# EAGLE design Braille_drive (EAGLE 9.4.2)
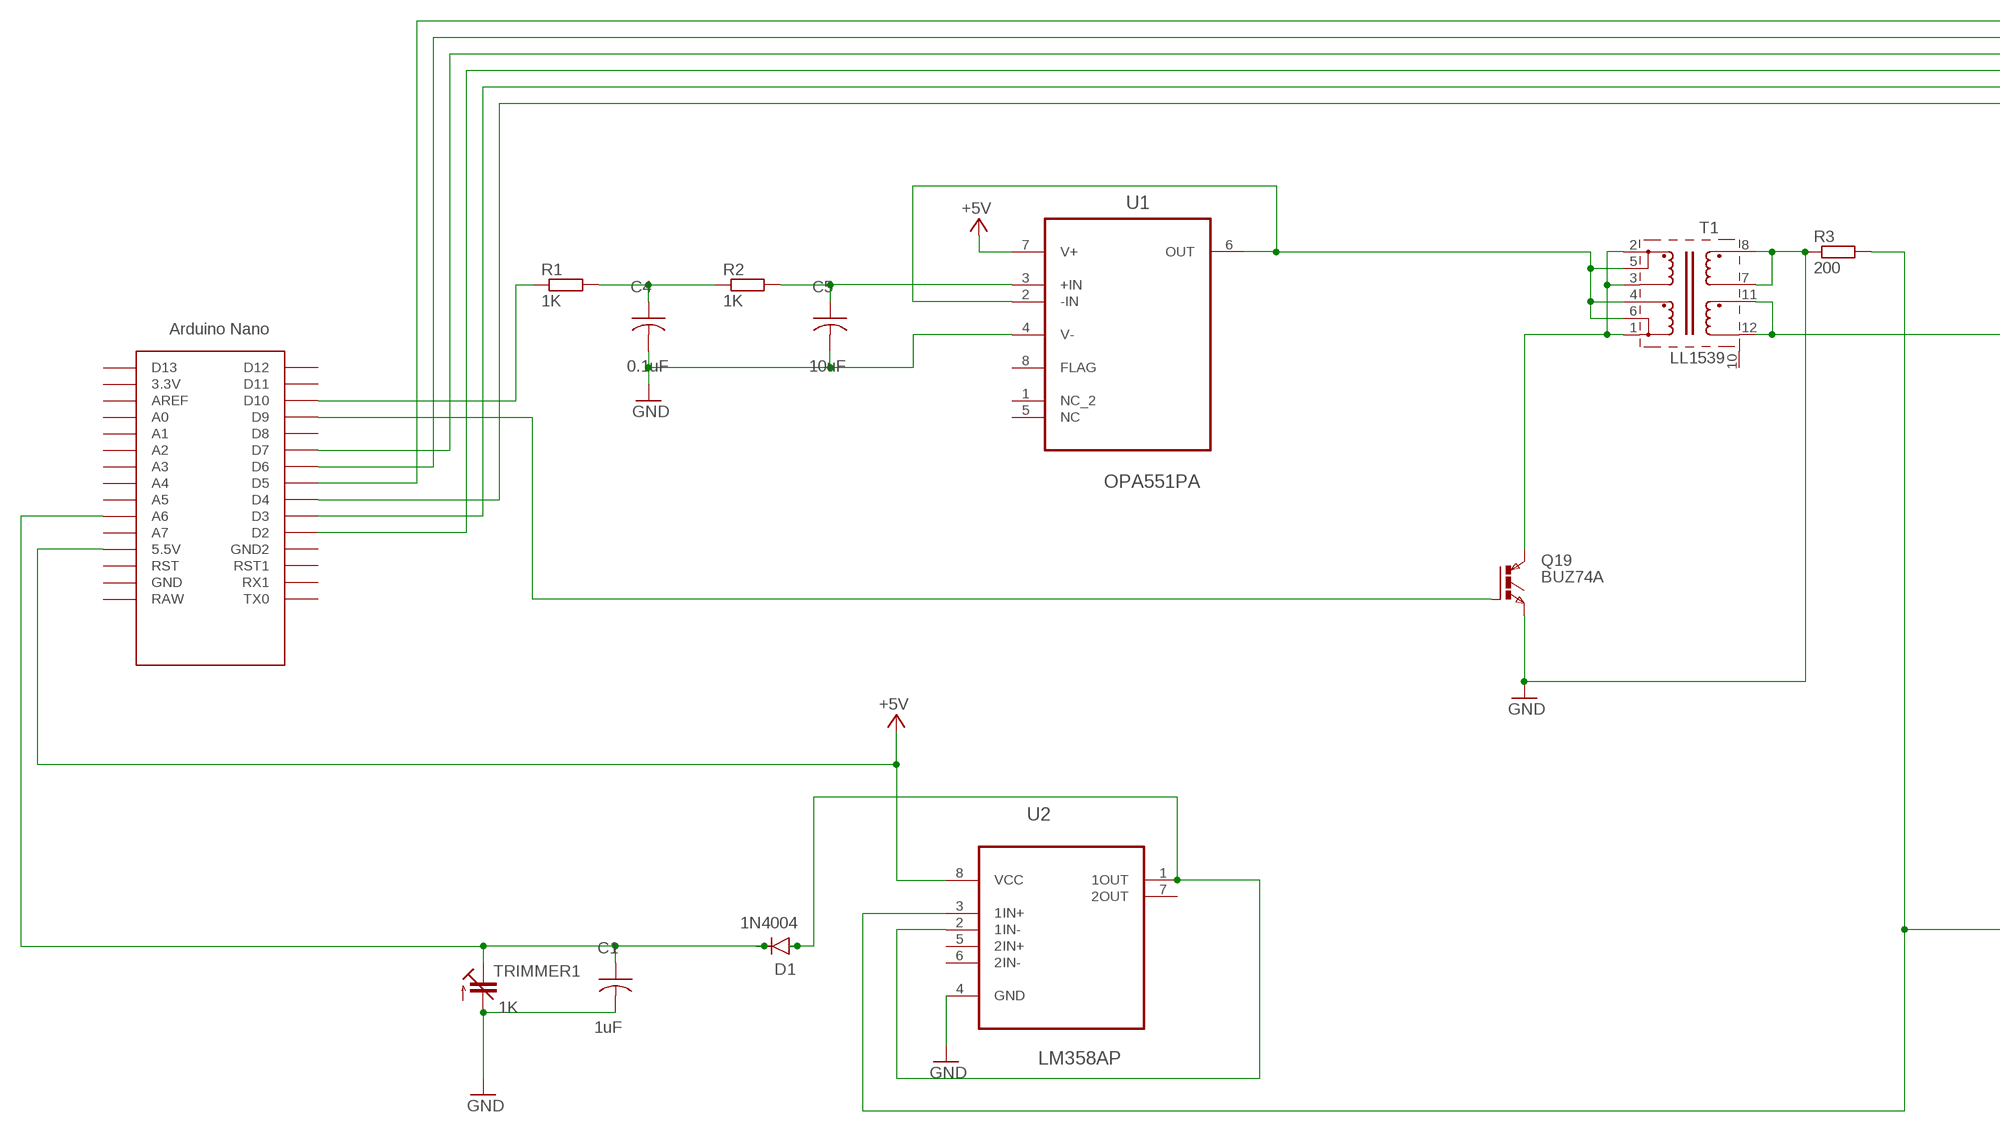
[diagram p0: schematic, sheet 1, part 1 of 2]
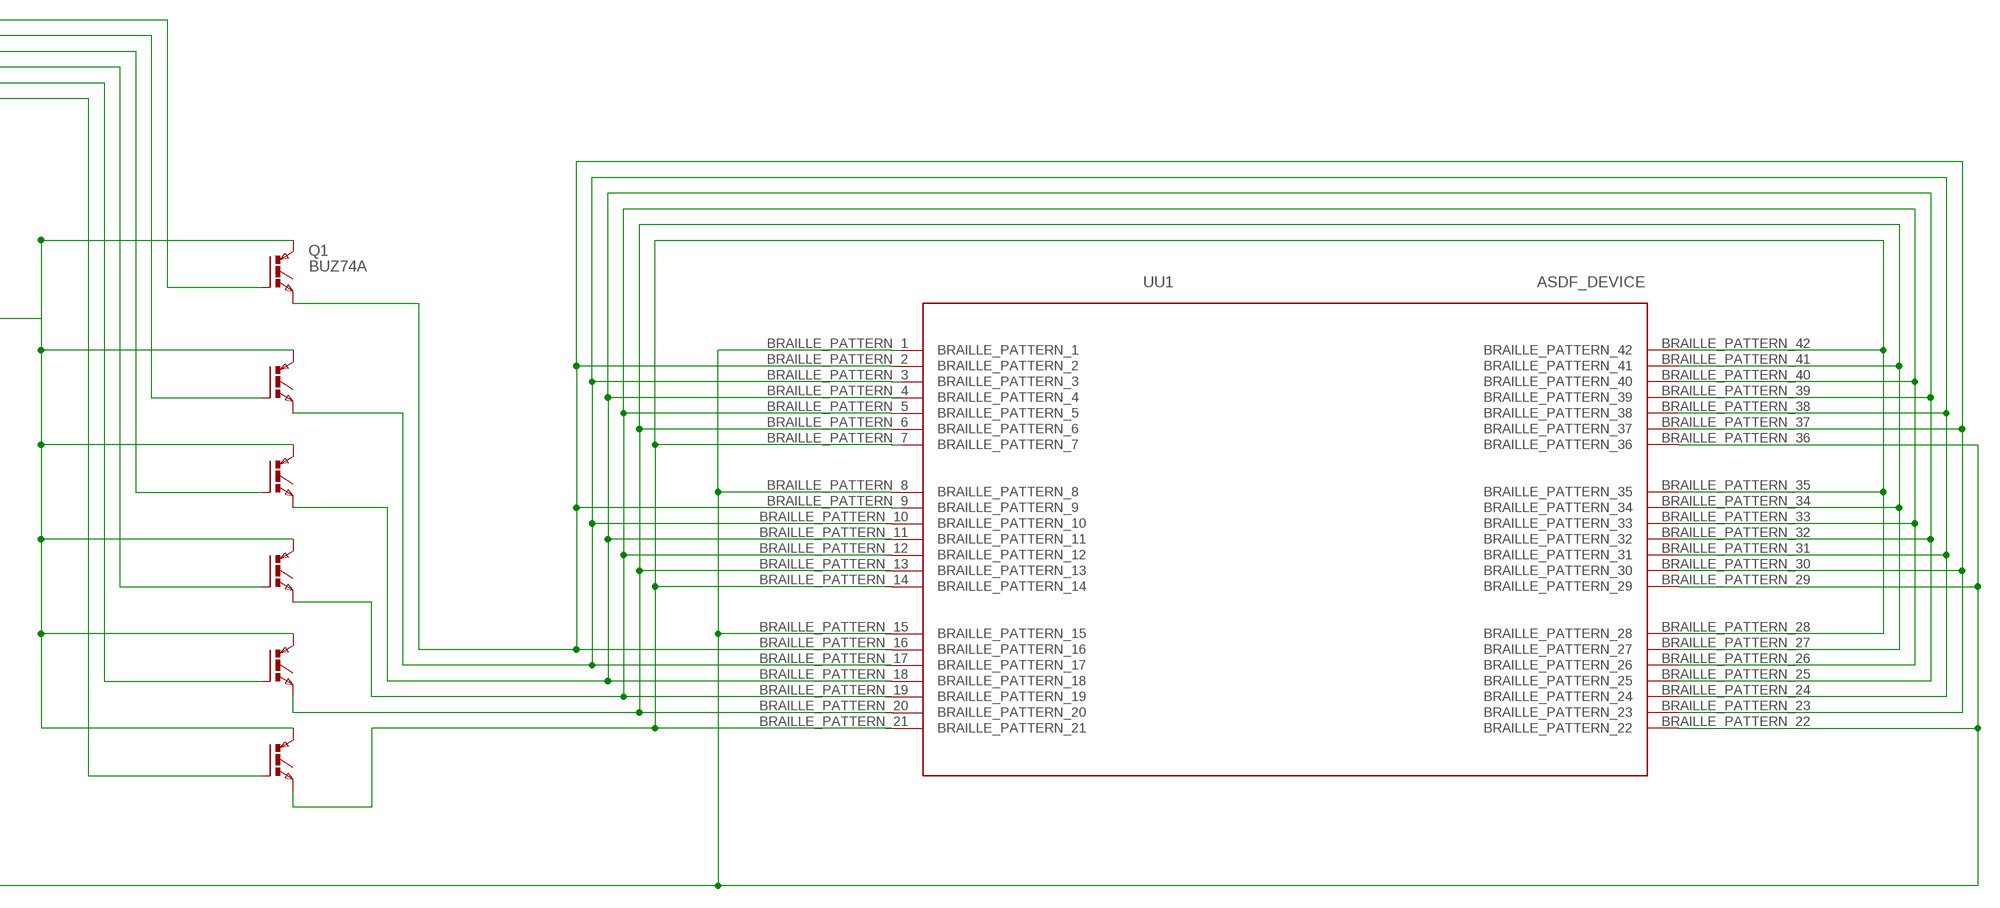
[diagram p1: schematic, sheet 1, part 2 of 2]

## Parts
C1  1uF  ECA-1HM100  [CAP_RADIAL_2MM]
C4  0.1uF  ECA-1HM100  [CAP_RADIAL_2MM]
C5  10uF  ECA-1HM100  [CAP_RADIAL_2MM]
D1  1N4004  [DO-41]
Q1  BUZ74A  IGBTTO220AV  [TO220AV]
Q2  BUZ74A  IGBTTO220AV  [TO220AV]
Q3  BUZ74A  IGBTTO220AV  [TO220AV]
Q4  BUZ74A  IGBTTO220AV  [TO220AV]
Q5  BUZ74A  IGBTTO220AV  [TO220AV]
Q6  BUZ74A  IGBTTO220AV  [TO220AV]
Q19  BUZ74A  IGBTTO220AV  [TO220AV]
R1  1K  R-EU_0204/2V  [0204V]
R2  1K  R-EU_0204/2V  [0204V]
R3  200  R-EU_0204/2V  [0204V]
T1  LL1539  [LL1539]
TRIMMER1  1K  C-TRIMM3040.452  [CTRIM3040.452]
U1  OPA551PA  [DIP254P762X508-8]
U2  LM358AP  [DIP254P762X508-8]
U$1  NANO  [NANO]
UU1  ASDF_DEVICE  [BRAILLE_PATTERN1]

## Nets
+5V: U1.7(V+) U2.8(VCC) U$1.5V(5.5V)
GND: C1.2 C4.2 C5.2 Q19.E R3.1 T1.7 T1.8 TRIMMER1.2(A) U1.4(V-) U2.4(GND)
N$1: R1.1 U$1.D10
N$2: C4.1 R1.2 R2.1
N$3: C5.1 R2.2 U1.3(+IN)
N$4: T1.4 T1.5 T1.6 U1.2(-IN) U1.6(OUT)
N$5: Q19.C T1.1 T1.2 T1.3
N$6: Q19.G U$1.D9
N$7: D1.A U2.1(1OUT) U2.2(1IN-)
N$8: C1.1 D1.C TRIMMER1.1A(E) U$1.A6
N$9: Q6.G U$1.D4
N$10: Q5.G U$1.D3
N$11: Q1.C Q2.C Q3.C Q4.C Q5.C Q6.C T1.11 T1.12
N$12: Q4.G U$1.D2
N$13: Q6.E UU1.BRAILLE_PATTERN_7 UU1.BRAILLE_PATTERN_14 UU1.BRAILLE_PATTERN_21 UU1.BRAILLE_PATTERN_28 UU1.BRAILLE_PATTERN_35 UU1.BRAILLE_PATTERN_42
N$14: Q3.G U$1.D7
N$15: Q2.G U$1.D6
N$16: Q1.G U$1.D5
N$17: R3.2 U2.3(1IN+) UU1.BRAILLE_PATTERN_1 UU1.BRAILLE_PATTERN_8 UU1.BRAILLE_PATTERN_15 UU1.BRAILLE_PATTERN_22 UU1.BRAILLE_PATTERN_29 UU1.BRAILLE_PATTERN_36
N$18: Q5.E UU1.BRAILLE_PATTERN_6 UU1.BRAILLE_PATTERN_13 UU1.BRAILLE_PATTERN_20 UU1.BRAILLE_PATTERN_27 UU1.BRAILLE_PATTERN_34 UU1.BRAILLE_PATTERN_41
N$22: Q1.E UU1.BRAILLE_PATTERN_2 UU1.BRAILLE_PATTERN_9 UU1.BRAILLE_PATTERN_16 UU1.BRAILLE_PATTERN_23 UU1.BRAILLE_PATTERN_30 UU1.BRAILLE_PATTERN_37
N$23: Q4.E UU1.BRAILLE_PATTERN_5 UU1.BRAILLE_PATTERN_12 UU1.BRAILLE_PATTERN_19 UU1.BRAILLE_PATTERN_26 UU1.BRAILLE_PATTERN_33 UU1.BRAILLE_PATTERN_40
N$24: Q3.E UU1.BRAILLE_PATTERN_4 UU1.BRAILLE_PATTERN_11 UU1.BRAILLE_PATTERN_18 UU1.BRAILLE_PATTERN_25 UU1.BRAILLE_PATTERN_32 UU1.BRAILLE_PATTERN_39
N$25: Q2.E UU1.BRAILLE_PATTERN_3 UU1.BRAILLE_PATTERN_10 UU1.BRAILLE_PATTERN_17 UU1.BRAILLE_PATTERN_24 UU1.BRAILLE_PATTERN_31 UU1.BRAILLE_PATTERN_38
Unconnected: T1.10 U1.1(NC_2) U1.5(NC) U1.8(FLAG) U2.5(2IN+) U2.6(2IN-) U2.7(2OUT) U$1.3.3V U$1.A0 U$1.A1 U$1.A2 U$1.A3 U$1.A4 U$1.A5 U$1.A7 U$1.AREF U$1.D8 U$1.D11 U$1.D12 U$1.D13 U$1.GND U$1.GND1(GND2) U$1.ICSP1 U$1.ICSP2 U$1.ICSP3 U$1.ICSP4 U$1.ICSP5 U$1.ICSP6 U$1.RAW U$1.RST U$1.RST1 U$1.RX1 U$1.TX0

## Library data of the parts
C1 C4 C5 = Resistor_Capacitor:ECA-1HM100: CAP ALUM 10UF 20% 50V RADIAL Manufacturer's datasheet <https://media.digikey.com/pdf/Data%20Sheets/Panasonic%20Electronic%20Components/ECA-xxM%20Series,TypeA.pdf>; CREATED_BY: PCBLayout.com; DIGIKEY_PART_NUMBER: P5178-ND; MANUFACTURER: Panasonic Electronic Components; MPN: ECA-1HM100; PACKAGE: CAP RADIAL 2MM LS
D1 = Diodes:1N4004: DIODE GEN PURP 400V 1A DO41 Manufacturer's datasheet <https://www.mccsemi.com/pdf/Products/1N4001-1N4007(DO-41).pdf>; CREATED_BY: PCBLayout.com; DIGIKEY_PART_NUMBER: 1N4004MSCT-ND; MANUFACTURER: Micro Commercial Co; MPN: 1N4004; PACKAGE: DO-41
Q1-Q6 Q19 = IGBT:IGBT: IGBT
R1-R3 = resistor:R-EU_: RESISTOR, European symbol
T1 = lundahl:LL1539: LL1539 Transformer
TRIMMER1 = resistor:C-TRIMM: Trimm capacitor
U1 = Texas Instruments_By_element14_Batch_1:OPA551PA: OPERATIONAL AMPLIFIER; MPN: OPA551PA; OC_FARNELL: 4427191; OC_NEWARK: 75C5068; PACKAGE: PDIP; SUPPLIER: Texas Instruments
U2 = Texas Instruments_By_element14_Batch_1:LM358AP: OPERATIONAL AMPLIFIER; MPN: LM358AP; OC_FARNELL: 1459520; OC_NEWARK: 67K0318; PACKAGE: PDIP; SUPPLIER: Texas Instruments
U$1 = Arduino-clone:NANO: Arduino Nano
UU1 = braille:ASDF_DEVICE

## Board
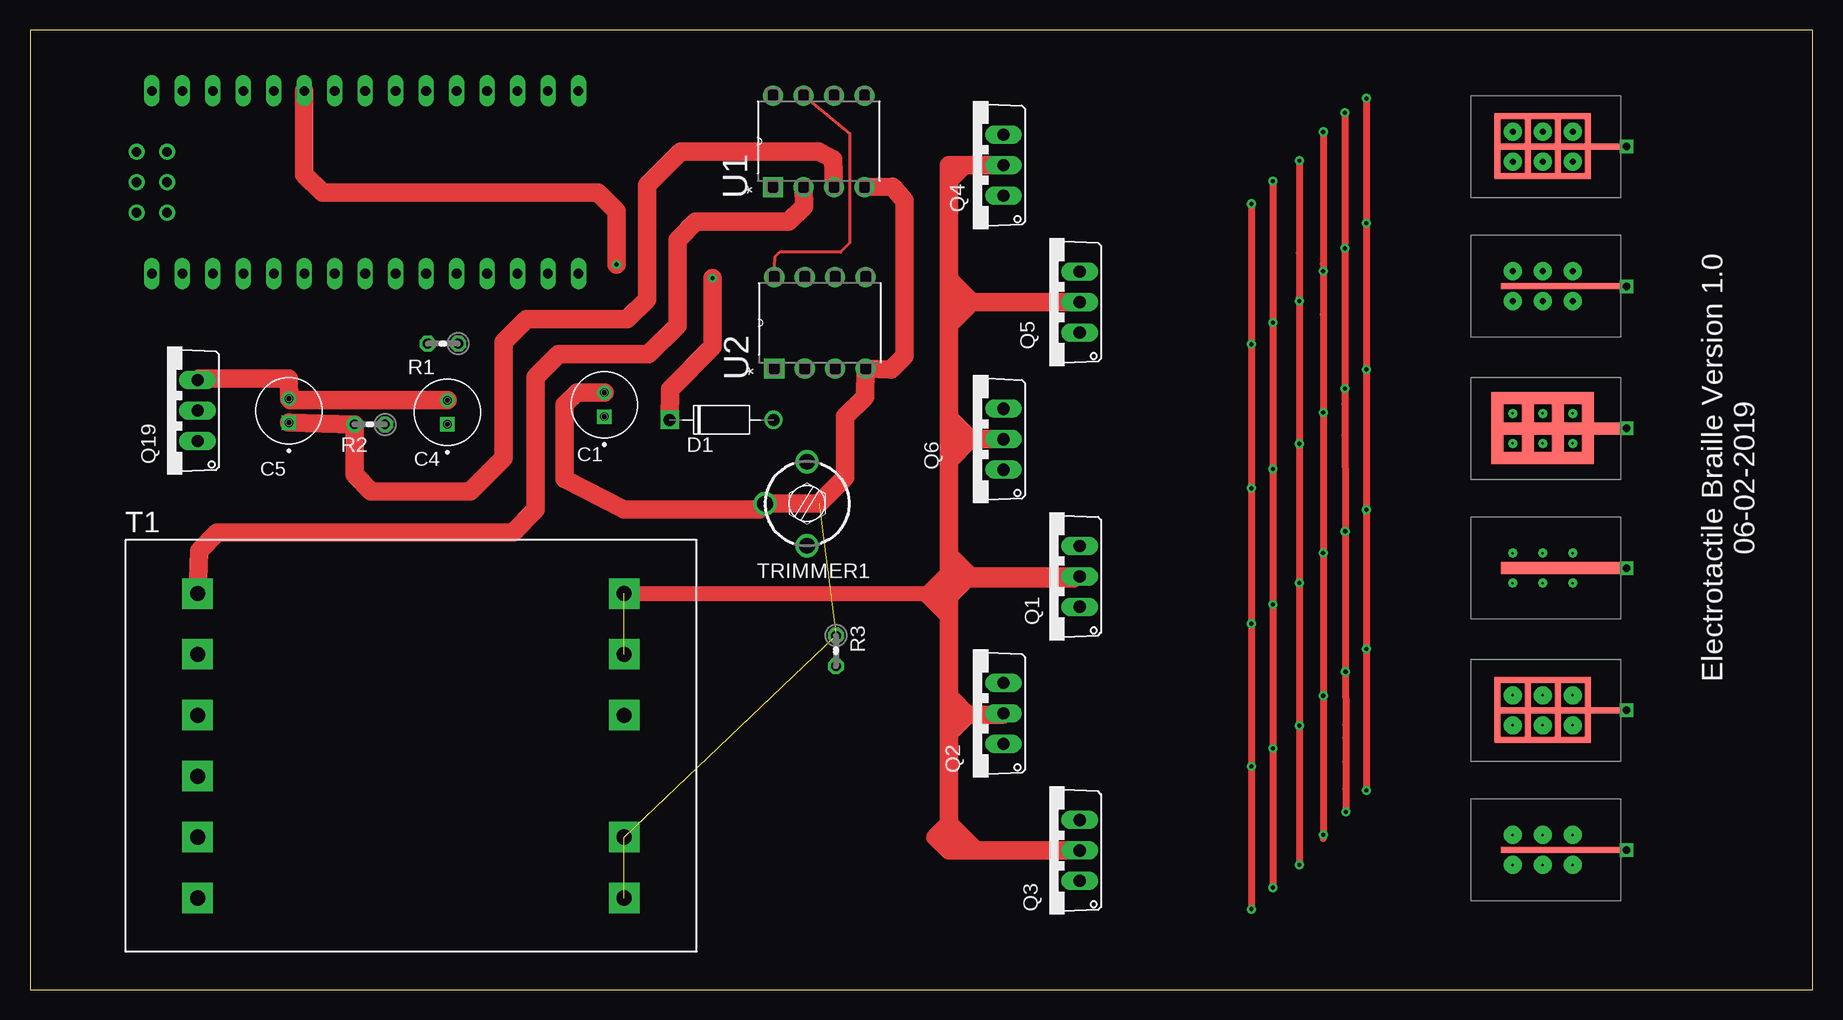
[diagram p2: board, top side]
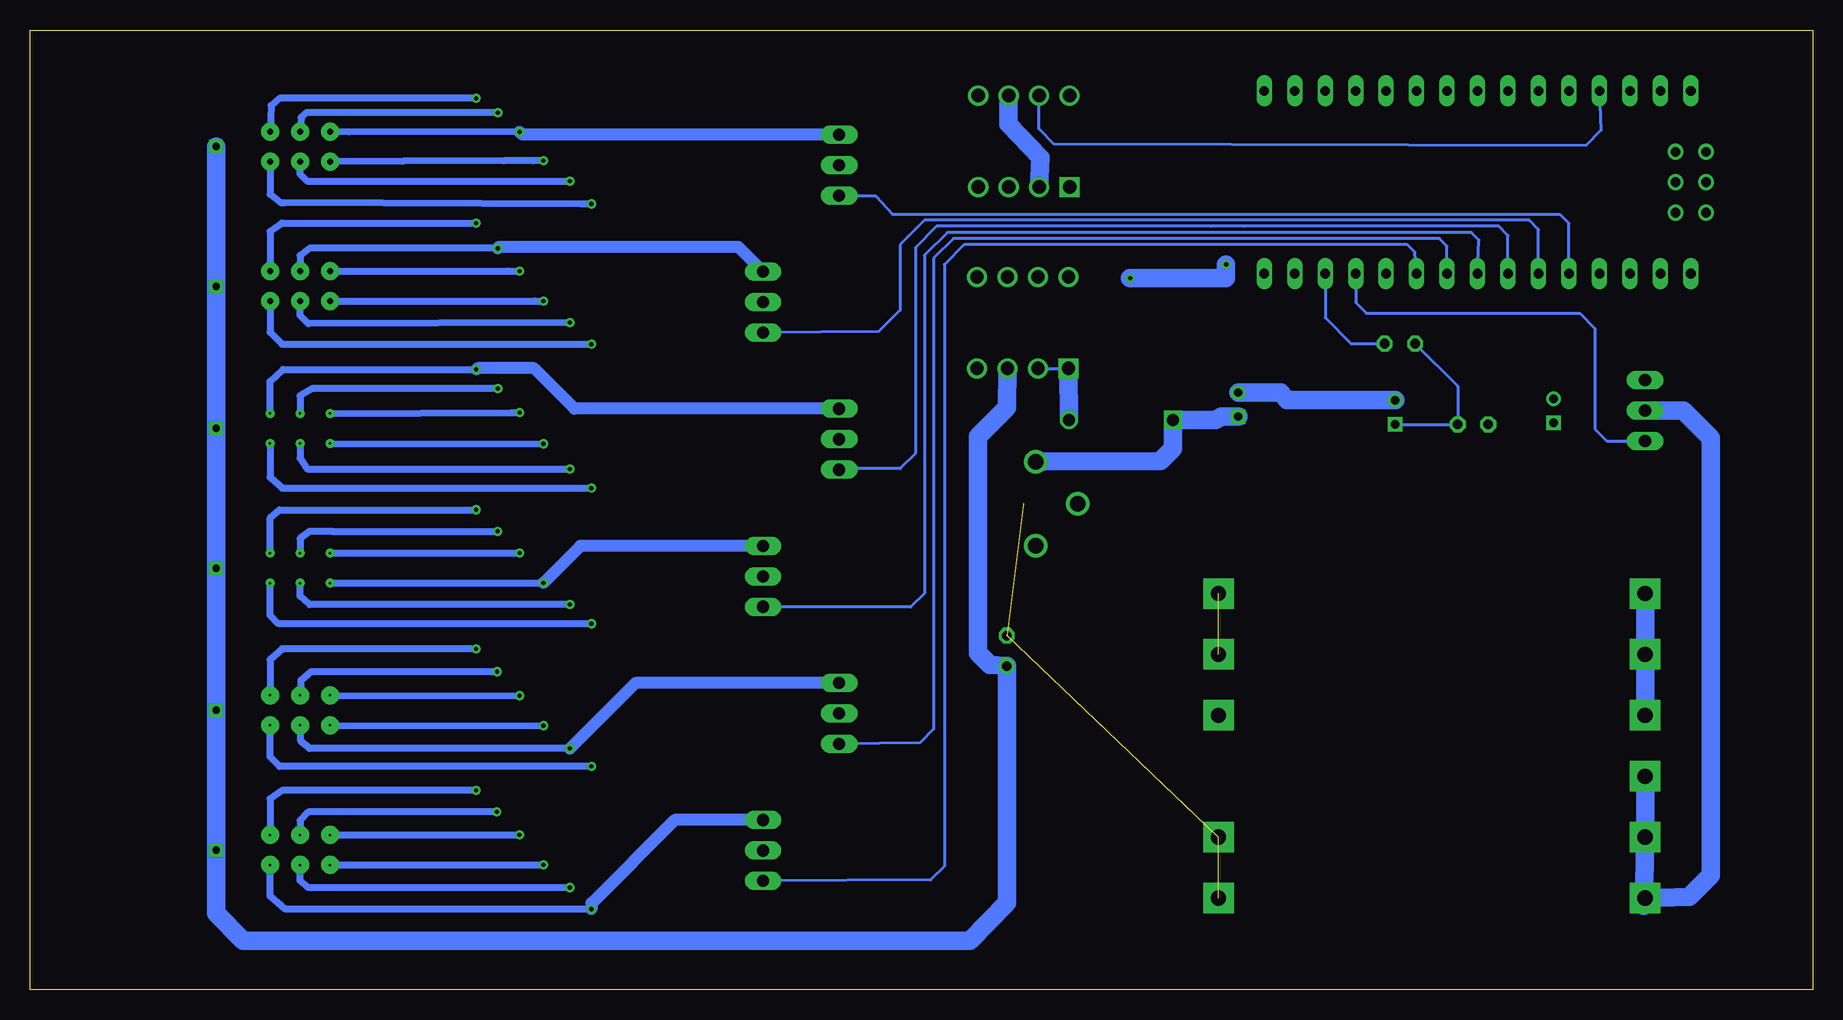
[diagram p3: board, bottom side, seen from below]

Size 148.6 x 80 mm. Coordinates in mm from the lower left corner, seen from the top.
Outline: 0,0 148.6,0 148.6,80 0,80 0,0
Copper layers (1*16): Top 0.035mm / dielectric 1.5mm / Bottom 0.035mm
Design rules "default *": minimum track width 0.1mm, minimum drill 0.35mm, track to track 10mil, track to pad 10mil, pad to pad 10mil, via to via 10mil, smd to smd 10mil, copper to edge 10mil, drill to drill 6mil, minimum pad ring 10mil, minimum via ring 8mil, stop-mask expansion 4mil, vias tented up to drill 0mil, thermal gap 10mil

### Footprints (pad centres in the part's own frame; a part is rotated, then mirrored left to right if it is on the bottom)
CAP_RADIAL_2MM = drill 0.7 pad 1.1 square: 1 -1,0 | drill 0.7 pad 1.1: 2 1,0
DO-41 = drill 1: A 4.325,0 | drill 1 square: C -4.325,0
TO220AV = drill 1.016 long: C 0,-2.54; E 2.54,-2.54; G -2.54,-2.54
0204V = drill 0.813 octagon: 1 -1.27,0; 2 1.27,0
LL1539 = drill 1.27 pad 2.54 square: 1 -17.78,-12.7; 2 -17.78,-7.62; 3 -17.78,-2.54; 4 -17.78,2.54; 5 -17.78,7.62; 6 -17.78,12.7; 7 17.78,-12.7; 8 17.78,-7.62; 10 17.78,2.54; 11 17.78,7.62; 12 17.78,12.7
CTRIM3040.452 = drill 1.3: 1A -3.5,0; 1B 3.5,0; 2 0,-3.5
DIP254P762X508-8 = drill 1.118 square: 1 -7.62,7.62 | drill 1.118: 2 -7.62,5.08; 3 -7.62,2.54; 4 -7.62,0; 5 0,0; 6 0,2.54; 7 0,5.08; 8 0,7.62
NANO = drill 0.8 long: 3.3V -10.16,24.13; 5V -10.16,-1.27; A0 -10.16,19.05; A1 -10.16,16.51; A2 -10.16,13.97; A3 -10.16,11.43; A4 -10.16,8.89; A5 -10.16,6.35; A6 -10.16,3.81; A7 -10.16,1.27; AREF -10.16,21.59; D2 5.08,1.27; D3 5.08,3.81; D4 5.08,6.35; D5 5.08,8.89; D6 5.08,11.43; D7 5.08,13.97; D8 5.08,16.51; D9 5.08,19.05; D10 5.08,21.59; D11 5.08,24.13; D12 5.08,26.67; D13 -10.16,26.67; GND -10.16,-6.35; GND1 5.08,-1.27; RAW -10.16,-8.89; RST -10.16,-3.81; RST1 5.08,-3.81; RX1 5.08,-6.35; TX0 5.08,-8.89 | drill 0.8: ICSP1 -5.08,-10.16; ICSP2 -5.08,-7.62; ICSP3 -2.54,-10.16; ICSP4 -2.54,-7.62; ICSP5 0,-10.16; ICSP6 0,-7.62
BRAILLE_PATTERN1 = smd 1 x 10: BRAILLE_PATTERN1 25.38,-4; BRAILLE_PATTERN9 37.04,-4 | smd 1 x 8: BRAILLE_PATTERN17 39.58,-2.5; BRAILLE_PATTERN18 34.58,-2.5 | smd 6 x 1: BRAILLE_PATTERN19 37.08,1.26; BRAILLE_PATTERN20 37.08,-6.25 | smd 5.4 x 1: BRAILLE_PATTERN21 37.08,-3.75; BRAILLE_PATTERN22 37.08,-1.25 | smd 0.5 x 10: BRAILLE_PATTERN29 48.88,-4; BRAILLE_PATTERN37 60.54,-4; BRAILLE_PATTERN51 1.88,-4; BRAILLE_PATTERN59 13.54,-4 | smd 0.5 x 8: BRAILLE_PATTERN39 63.08,-2.5; BRAILLE_PATTERN41 58.08,-2.5; BRAILLE_PATTERN61 16.08,-2.5; BRAILLE_PATTERN63 11.08,-2.5 | smd 5.4 x 0.5: BRAILLE_PATTERN40 60.58,1.26; BRAILLE_PATTERN42 60.58,-6.25; BRAILLE_PATTERN43 60.58,-3.75; BRAILLE_PATTERN44 60.58,-1.25; BRAILLE_PATTERN62 13.58,1.26; BRAILLE_PATTERN64 13.58,-6.25; BRAILLE_PATTERN65 13.58,-3.75; BRAILLE_PATTERN66 13.58,-1.25 | drill 0.6 square: BRAILLE_PATTERN_1 1.88,-9.5; BRAILLE_PATTERN_8 13.54,-9.5; BRAILLE_PATTERN_15 25.38,-9.5; BRAILLE_PATTERN_22 37.04,-9.5; BRAILLE_PATTERN_29 48.88,-9.5; BRAILLE_PATTERN_36 60.54,-9.5 | drill 0.2 pad 1.5: BRAILLE_PATTERN_2 0.63,0; BRAILLE_PATTERN_3 0.63,-2.5; BRAILLE_PATTERN_4 0.63,-5; BRAILLE_PATTERN_5 3.13,0; BRAILLE_PATTERN_6 3.13,-2.5; BRAILLE_PATTERN_7 3.13,-5; BRAILLE_PATTERN_9 12.29,0; BRAILLE_PATTERN_10 12.29,-2.5; BRAILLE_PATTERN_11 12.29,-5; BRAILLE_PATTERN_12 14.79,0; BRAILLE_PATTERN_13 14.79,-2.5; BRAILLE_PATTERN_14 14.79,-5 | drill 0.2 pad 0.75: BRAILLE_PATTERN_16 24.13,0; BRAILLE_PATTERN_17 24.13,-2.5; BRAILLE_PATTERN_18 24.13,-5; BRAILLE_PATTERN_19 26.63,0; BRAILLE_PATTERN_20 26.63,-2.5; BRAILLE_PATTERN_21 26.63,-5; BRAILLE_PATTERN_23 35.79,0; BRAILLE_PATTERN_24 35.79,-2.5; BRAILLE_PATTERN_25 35.79,-5; BRAILLE_PATTERN_26 38.29,0; BRAILLE_PATTERN_27 38.29,-2.5; BRAILLE_PATTERN_28 38.29,-5 | drill 0.5 pad 1.5: BRAILLE_PATTERN_30 47.63,0; BRAILLE_PATTERN_31 47.63,-2.5; BRAILLE_PATTERN_32 47.63,-5; BRAILLE_PATTERN_33 50.13,0; BRAILLE_PATTERN_34 50.13,-2.5; BRAILLE_PATTERN_35 50.13,-5; BRAILLE_PATTERN_37 59.29,0; BRAILLE_PATTERN_38 59.29,-2.5; BRAILLE_PATTERN_39 59.29,-5; BRAILLE_PATTERN_40 61.79,0; BRAILLE_PATTERN_41 61.79,-2.5; BRAILLE_PATTERN_42 61.79,-5

### Placement (x,y rotation side)
C1  47.88,48.77 90 top
C4  34.8,48.13 90 top
C5  21.59,48.26 90 top
D1  57.66,47.5 0 top
Q1  84.96,34.45 90 top
Q2  78.61,23.02 90 top
Q3  84.96,11.59 90 top
Q4  78.61,68.74 90 top
Q5  84.96,57.31 90 top
Q6  78.61,45.88 90 top
Q19  11.43,48.26 90 top
R1  34.42,53.85 180 top
R2  28.32,47.12 180 top
R3  67.18,28.24 270 top
T1  31.75,20.32 0 top
TRIMMER1  64.77,40.51 270 top
U1  69.56,74.53 90 top
U2  69.66,59.4 90 top
U$1  19.05,64.77 270 top
UU1  123.59,9.75 90 top

### Tracks (layer width: path | path; a pad name or v marks a point on that pad's centre or on a via)
+5V
  Top 0.254: U1.7 68.33,71.37 68.33,62.23 67.56,61.47 62.48,61.47 62.1,61.09 U2.8
  Bottom 0.254: U$1.5V 17.65,71.63 18.92,70.36 63.25,70.48 64.52,71.75 64.5,73.28 U1.7
GND  (3 unrouted)
  Top 1.524: Q19.E 14.1,50.93 21.57,50.93 C5.2 21.7,49.15 C4.2 | U1.4 71.88,66.93 72.9,65.79 72.9,52.83 71.75,51.69 U2.4 69.6,49.4 67.94,47.75 67.94,42.67 65.79,40.51 TRIMMER1.2 60.76,40.01 49.53,40.01 44.58,42.55 44.58,48.77 45.59,49.78 C1.2
  Bottom 1.524: C4.2 43.81,49.15 44.32,49.78 C1.2
N$1
  Bottom 0.254: U$1.D10 40.64,56.01 38.48,53.85 R1.1
N$2
  Bottom 0.254: R1.2 29.59,50.29 R2.1 34.8,47.12 C4.1
N$3
  Top 1.524: C5.1 R2.2 27.05,42.93 28.45,41.53 36.7,41.53 39.5,44.32 39.5,53.98 41.4,55.88 49.78,55.88 51.44,57.53 51.44,67.06 54.23,69.85 65.79,69.85 66.93,69.22 U1.3
N$4
  Top 1.524: U1.2 64.52,65.28 63.25,64.01 55.5,64.01 53.98,62.48 53.98,55.37 51.56,52.96 44.07,52.96 42.16,51.05 42.16,40.01 40.26,38.1 15.62,38.1 14.1,36.58 T1.6
  Bottom 1.524: T1.4 T1.5 T1.6 | U1.6 67.06,72.14 64.39,69.34 U1.2
N$5
  Bottom 1.524: Q19.C 10.79,48.26 8.51,45.97 8.51,9.53 10.29,7.75 T1.1 14.1,6.99 T1.2 T1.3
N$6
  Bottom 0.254: U$1.D9 38.1,57.28 37.21,56.39 19.43,56.39 18.16,55.12 18.16,46.74 17.14,45.72 Q19.G
N$7
  Bottom 0.254: U2.2 U2.1
  Bottom 1.524: D1.A U2.1
N$8  (via drill 0.35)
  Top 1.524: D1.C 53.34,50.04 56.9,53.59 v56.9,59.31 | v48.9,60.45 48.9,64.9 47.37,66.42 24.38,66.42 22.86,67.94 U$1.A6
  Bottom 0.254: 50.29,47.75 50.67,47.5 53.09,47.5 D1.C | 64.14,44.04 TRIMMER1.1A
  Bottom 1.524: C1.1 49.28,47.75 49.78,47.5 53.09,47.5 | D1.C 53.34,45.09 54.36,44.07 64.14,44.04 | v56.9,59.31 48.9,59.31 v48.9,60.45
N$9
  Bottom 0.254: U$1.D4 25.4,62.87 26.16,63.63 47.37,63.63 50.16,63.63 73.03,63.63 74.8,61.85 74.8,44.7 76.07,43.43 80.14,43.43 Q6.G
N$10
  Bottom 0.254: U$1.D3 22.86,63.37 23.62,64.14 74.04,64.14 76.07,62.1 76.07,56.64 77.85,54.86 Q5.G
N$11  (1 unrouted)
  Top 0.406: 76.35,33.02 76.6,33.27 | 76.6,34.42 75.2,33.02 74.8,33.02 74.8,32.78 | 76.6,34.82 76.6,35.31
  Top 1: Q1.C 87.05,34 76.6,34 | 77.22,45.88 76.6,45.88 | 77.09,57.31 76.6,57.31 | 76.6,59.18 76.6,57.31 | 76.6,57.31 76.6,54.99 | 76.6,48.39 76.6,45.88 | 76.6,45.88 76.6,44.07 | 76.6,34.42 76.6,34 | 76.6,34 76.6,33.27 76.6,32.51
  Top 1.27: T1.12 74.8,33.02 | 76.35,33.02 74.8,33.02 | 74.8,33.02 76.6,34.82 | 76.6,30.99 74.8,32.78
  Top 1.524: Q4.C 77.85,68.74 | 77.85,68.74 76.6,68.74 76.6,67.69 | 76.6,67.69 76.6,59.18 | 76.6,59.18 76.6,55.42 | 76.6,47.64 76.6,44.12 | 76.6,36.2 76.6,44.07 76.6,44.12 | 76.6,36.2 76.6,35.31 76.6,34.42 | 76.6,34.42 76.6,33.27 76.6,32.82 | 76.6,24.13 76.6,30.99 76.6,32.51 76.6,32.82 | 76.6,24.13 76.6,22.9 | 76.6,22.9 78.11,22.9 | 78.11,22.9 81.03,22.9 Q2.C | Q1.C 78.23,34.45 | 78.23,34.45 76.63,34.45 76.6,34.42 | Q6.C 78.36,45.88 | 78.36,45.88 77.22,45.88 | Q5.C 78.49,57.31 | 78.49,57.31 77.09,57.31 | Q3.C 78.82,11.59 | 78.82,11.59 76.6,11.59 | 76.6,22.9 76.6,21.46 | 76.6,21.46 76.6,13.81 | 76.6,13.81 76.6,11.59 | 76.6,11.59 75.49,12.7 76.6,13.81 | 76.6,13.81 78.82,11.59 | 77.85,68.74 76.8,67.69 76.6,67.69 | 78.49,57.31 76.6,55.42 | 76.6,55.42 76.6,54.99 76.6,48.39 76.6,47.64 | 78.49,57.31 76.61,59.18 76.6,59.18 | 78.36,45.88 76.6,44.12 | 78.36,45.88 76.6,47.64 | 76.6,36.2 78.23,34.56 78.23,34.45 | 78.23,34.45 76.6,32.82 | 78.11,22.9 76.88,24.13 76.6,24.13 | 78.11,22.9 76.67,21.46 76.6,21.46
N$12
  Bottom 0.254: U$1.D2 20.32,63.88 21.08,64.64 76.71,64.64 78.11,66.17 Q4.G
N$13  (via drill 0.35)
  Top 0.6: v111.4,74.3 v111.4,63.9 v111.4,51.7 v111.4,40 v111.4,28.4 v111.4,16.6
  Bottom 0.6: UU1.BRAILLE_PATTERN_42 128.5,73.7 127.8,74.3 v111.4,74.3 | UU1.BRAILLE_PATTERN_35 128.6,63.2 127.6,63.9 v111.4,63.9 | UU1.BRAILLE_PATTERN_28 128.6,50.7 127.5,51.7 v111.4,51.7 | UU1.BRAILLE_PATTERN_21 128.6,39.3 127.8,40 v111.4,40 | UU1.BRAILLE_PATTERN_14 128.6,27.5 127.6,28.4 v111.4,28.4 | UU1.BRAILLE_PATTERN_7 128.6,15.9 127.6,16.6 v111.4,16.6
  Bottom 1: Q6.E 103.22,48.42 106.6,51.8 111.3,51.8 v111.4,51.7
N$14
  Bottom 0.254: U$1.D7 33.15,61.47 33.78,62.1 70.74,62.1 72.39,60.45 72.39,10.29 73.53,9.14 Q3.G
N$15
  Bottom 0.254: U$1.D6 30.48,61.98 31.11,62.61 46.23,62.61 46.99,62.61 71.63,62.61 73.28,60.96 73.28,21.72 74.42,20.57 Q2.G
N$16
  Bottom 0.254: U$1.D5 27.81,62.48 28.45,63.12 47.24,63.12 48.39,63.12 72.14,63.12 74.04,61.21 74.04,33.02 75.18,31.88 Q1.G
N$17
  Bottom 1.524: UU1.BRAILLE_PATTERN_36 UU1.BRAILLE_PATTERN_29 UU1.BRAILLE_PATTERN_22 UU1.BRAILLE_PATTERN_15 UU1.BRAILLE_PATTERN_8 UU1.BRAILLE_PATTERN_1 133.1,6.35 130.81,4.06 70.23,4.06 67.18,7.24 R3.2 68.58,27.05 69.6,28.07 69.6,46.1 67.18,48.51 U2.3
N$18  (via drill 0.35)
  Top 0.6: v109.6,73.1 v109.6,61.8 v109.6,50.1 109.6,48.8 | 109.6,48.8 109.6,46.2 | 109.6,48.8 v109.63,38.2 v109.66,26.5 109.67,22.1 | 109.67,22.1 109.67,21 109.68,19 109.69,16.7 | 109.67,22.1 v109.69,14.8
  Bottom 0.6: UU1.BRAILLE_PATTERN_41 126,72.7 125.6,73.1 v109.6,73.1 | UU1.BRAILLE_PATTERN_34 126.1,61.2 125.3,61.8 v109.6,61.8 | UU1.BRAILLE_PATTERN_27 126.1,49.5 125.1,50.1 v109.6,50.1 | v109.63,38.2 123.4,38.2 124.9,38.2 125.3,38.2 126.1,37.6 UU1.BRAILLE_PATTERN_20 | UU1.BRAILLE_PATTERN_13 126.03,25.79 125.2,26.5 v109.66,26.5 | UU1.BRAILLE_PATTERN_6 126.1,14.1 125.4,14.8 v109.69,14.8
  Bottom 1: Q5.E 89.55,61.9 109.5,61.9 v109.6,61.8
N$22  (via drill 0.35)
  Top 0.6: v105.8,69.09 105.8,61.4 | 105.8,61.4 105.8,57.7 | 105.8,61.4 v105.8,57.4 v105.8,45.5 v105.8,33.9 v105.8,22 v105.8,10.4
  Bottom 0.6: UU1.BRAILLE_PATTERN_37 117.5,69.06 109.1,69.08 | 106.7,69.09 109.1,69.08 | v105.8,69.09 109.1,69.08 | UU1.BRAILLE_PATTERN_30 106.5,57.4 v105.8,57.4 | UU1.BRAILLE_PATTERN_23 v105.8,45.5 | UU1.BRAILLE_PATTERN_16 v105.8,33.9 | UU1.BRAILLE_PATTERN_9 v105.8,22 | UU1.BRAILLE_PATTERN_2 v105.8,10.4
  Bottom 1: Q1.E 102.71,36.99 v105.8,33.9
N$23  (via drill 0.35)
  Top 0.6: v107.8,71.5 107.8,60.5 | 107.8,60.5 107.8,56.3 | 107.8,60.5 v107.8,59.9 v107.8,48.1 v107.8,36.4 v107.8,24.5 v107.8,12.9 107.8,12.6
  Bottom 0.6: v107.8,71.5 122,71.5 UU1.BRAILLE_PATTERN_40 | UU1.BRAILLE_PATTERN_33 108.8,59.9 v107.8,59.9 | UU1.BRAILLE_PATTERN_26 108.5,48.1 v107.8,48.1 | UU1.BRAILLE_PATTERN_19 v107.8,36.4 | UU1.BRAILLE_PATTERN_12 v107.8,24.5 | UU1.BRAILLE_PATTERN_5 v107.8,12.9
  Bottom 1: Q4.E 107.58,71.28 v107.8,71.5
N$24  (via drill 0.35)
  Top 0.6: v101.8,65.5 v101.8,53.8 v101.8,41.8 v101.8,30.5 v101.8,18.6 v101.8,6.7
  Bottom 0.6: UU1.BRAILLE_PATTERN_39 128.6,66.3 127.7,65.6 127.4,65.59 102.7,65.5 v101.8,65.5 | UU1.BRAILLE_PATTERN_32 128.6,54.8 127.6,53.8 v101.8,53.8 | UU1.BRAILLE_PATTERN_25 128.6,42.7 127.6,41.8 v101.8,41.8 | UU1.BRAILLE_PATTERN_18 128.6,31.2 127.9,30.5 v101.8,30.5 | UU1.BRAILLE_PATTERN_11 128.6,19.4 127.8,18.6 v101.8,18.6 | UU1.BRAILLE_PATTERN_4 128.6,7.8 127.3,6.7 v101.8,6.7
  Bottom 1: Q3.E 94.87,14.13 101.8,7.2 v101.8,6.7
N$25  (via drill 0.35)
  Top 0.6: v103.6,67.4 v103.6,55.6 v103.6,43.4 v103.6,32.1 v103.6,20.1 v103.6,8.5
  Bottom 0.6: UU1.BRAILLE_PATTERN_38 126.1,68 125.5,67.4 v103.6,67.4 | UU1.BRAILLE_PATTERN_31 126.1,56.2 125.4,55.5 v103.6,55.6 | UU1.BRAILLE_PATTERN_24 126.1,44.3 125.5,43.4 v103.6,43.4 | UU1.BRAILLE_PATTERN_17 126.1,32.8 125.3,32.1 v103.6,32.1 | UU1.BRAILLE_PATTERN_10 126.03,20.7 125.3,20.1 v103.6,20.1 | UU1.BRAILLE_PATTERN_3 126.1,9.1 125.4,8.5 v103.6,8.5
  Bottom 1: Q2.E 98.14,25.56 v103.6,20.1

### Text on the board
tNames: Electrotactile Braille Version 1.0 / 06-02-2019